# EAGLE design String Shooter (EAGLE 9.6.2)
REVISION: 1.0; SCH_DESC: An Example Schematic; TEAM: Example_Team_Number
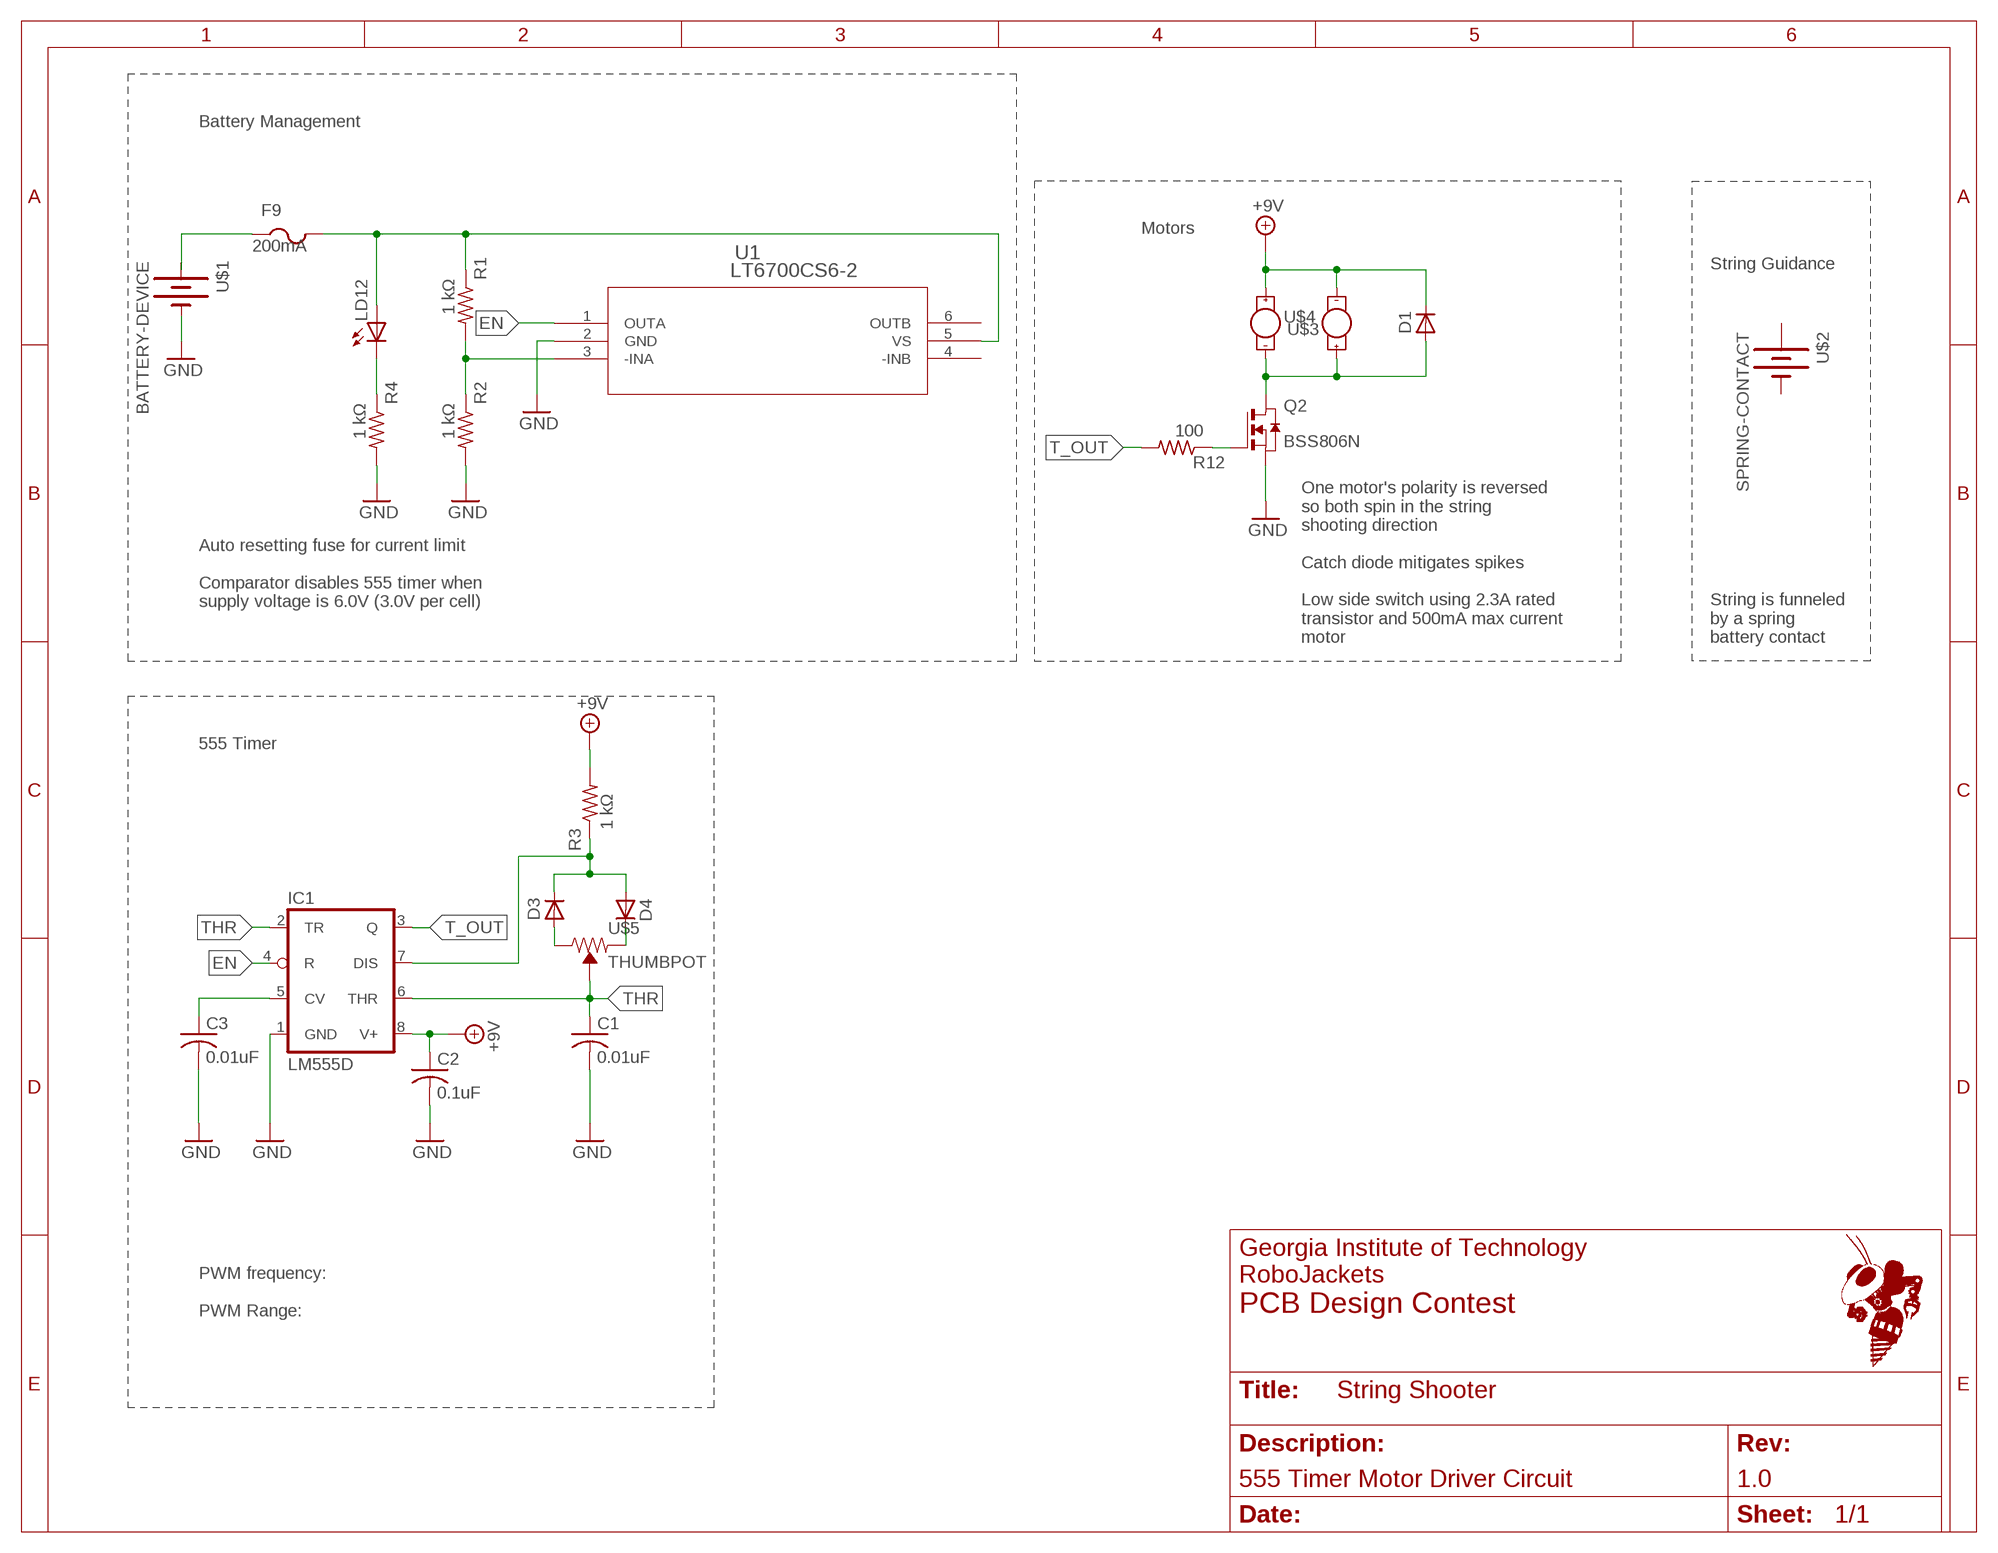
[diagram p0: schematic, sheet 1]
FRAME2 (FRAME_A_L): REVISION: 1.0; SCH_DESC: 555 Timer Motor Driver Circuit; TEAM: PCB Design Contest

## Parts
C1  0.01uF  C-USC0603  [C0603]
C2  0.1uF  C-USC0603  [C0603]
C3  0.01uF  C-USC0603  [C0603]
D1  DIODE-DO-214AC  [DO-214AC]
D3  DIODE-DO-214AC  [DO-214AC]
D4  DIODE-DO-214AC  [DO-214AC]
F9  200mA  PTCFUSE-1206  [R1206]
IC1  LM555D  [SO08]
LD12  BLUE  LEDCHIP-LED0603  [CHIP-LED0603]
Q2  BSS806N  [SOT-23-3]
R1  1 kΩ  R-US_R0603  [R0603]
R2  1 kΩ  R-US_R0603  [R0603]
R3  1 kΩ  R-US_R0603  [R0603]
R4  1 kΩ  R-US_R0603  [R0603]
R12  100  R-US_R0603  [R0603]
U1  LT6700CS6-2  [TSOT-23_S6]
U$1  BATTERY-DEVICE  [BATTERY-CASE]
U$2  SPRING-CONTACT  [SPRING-CONTACT]
U$3  LITTLE-MOTOR  [DC_MOTOR]
U$4  LITTLE-MOTOR  [DC_MOTOR]
U$5  THUMBPOT  [THUMBWHEEL-POT]

## Nets
+9V: C2.1 D1.C IC1.8(V+) R3.2
EN: IC1.4(R) U1.1(OUTA)
GND: C1.2 C2.2 C3.2 IC1.1(GND) Q2.2(S) R2.2 R4.2 U1.2(GND)
N$1: D4.C U$5.P$1(CCW)
N$2: D1.A Q2.3(D)
N$3: C3.1 IC1.5(CV)
N$10: D3.A U$5.P$3(CW)
N$11: D3.C D4.A IC1.7(DIS) R3.1
N$12: Q2.1(G) R12.1
N$13: R1.2 R2.1 U1.3(-INA)
N$14: LD12.C R4.1
N$15: F9.2 LD12.A R1.1 U1.5(VS)
N$16: F9.1
T_OUT: IC1.3(Q) R12.2
THR: C1.1 IC1.2(TR) IC1.6(THR) U$5.P$2(WIPER)
Unconnected: U1.4(-INB) U1.6(OUTB)

## Notes on the sheet
- Battery Management
- Motors
- String Guidance
- Auto resetting fuse for current limit
  
  Comparator disables 555 timer when
  supply voltage is 6.0V (3.0V per cell)
- One motor's polarity is reversed
  so both spin in the string
  shooting direction
  
  Catch diode mitigates spikes
  
  Low side switch using 2.3A rated
  transistor and 500mA max current
  motor
- String is funneled
  by a spring 
  battery contact
- 555 Timer
- PWM frequency:
  
  PWM Range:

## Library data of the parts
C1-C3 = rcl:C-US: CAPACITOR, American symbol; SPICEPREFIX: C
D1 D3 D4 = RoboJackets-Diodes:DIODE-: DIODE
F9 = adafruit:PTCFUSE: PTC fuses, resettable thermistors
IC1 = adafruit:*555: TIMER Changed DIP package to have round (not oval) pin pads http://www.ladyada.net/library/pcb/eaglelibrary.html
LD12 = led:LED: LED OSRAM: - CHIPLED LG R971, LG N971, LY N971, LG Q971, LY Q971, LO R971, LY R971 LH N974, LH R974 LS Q976, LO Q976, LY Q976 LO Q996 - Hyper CHIPLED LW Q18S LB Q993, LB Q99A, LB R99A - SideLED LS A670, LO A670, LY A670, LG A670, LP A670 LB A673, LV A673, LT A673, LW A673 LH A674 LY A675 LS A676, LA A676, LO A676, LY A676, LW A676 LS A679, LY A679, LG A679 - Hyper Micro SIDELED® LS Y876, LA Y876, LO Y876, LY Y876 LT Y87S - SmartLED LW L88C, LW L88S LB L89C, LB L89S, LG L890 LS L89K, LO L89K, LY L89K LS L896, LA L896, LO L896, LY L896 - TOPLED LS T670, LO T670, LY T670, LG T670, LP T670 LSG T670, LSP T670, LSY T670, LOP T670, LYG T670 LG T671, LOG T671, LSG T671 LB T673, LV T673, LT T673, LW T673 LH T674 LS T676, LA T676, LO T676, LY T676, LB T676, LH T676, LSB T676, LW T676 LB T67C, LV T67C, LT T67C, LS T67K, LO T67K, LY T67K, LW E67C LS E67B, LA E67B, LO E67B, LY E67B, LB E67C, LV E67C, LT E67C LW T67C LS T679, LY T679, LG T679 LS T770, LO T770, LY T770, LG T770, LP T770 LB T773, LV T773, LT T773, LW T773 LH T774 LS E675, LA E675, LY E675, LS T675 LS T776, LA T776, LO T776, LY T776, LB T776 LHGB T686 LT T68C, LB T68C - Hyper Mini TOPLED® LB M676 - Mini TOPLED Santana® LG M470 LS M47K, LO M47K, LY M47K Source: http://www.osram.convergy.de LUXEON: - LUMILED® LXK2-PW12-R00, LXK2-PW12-S00, LXK2-PW14-U00, LXK2-PW14-V00 LXK2-PM12-R00, LXK2-PM12-S00, LXK2-PM14-U00 LXK2-PE12-Q00, LXK2-PE12-R00, LXK2-PE12-S00, LXK2-PE14-T00, LXK2-PE14-U00 LXK2-PB12-K00, LXK2-PB12-L00, LXK2-PB12-M00, LXK2-PB14-N00, LXK2-PB14-P00, LXK2-PB14-Q00 LXK2-PR12-L00, LXK2-PR12-M00, LXK2-PR14-Q00, LXK2-PR14-R00 LXK2-PD12-Q00, LXK2-PD12-R00, LXK2-PD12-S00 LXK2-PH12-R00, LXK2-PH12-S00 LXK2-PL12-P00, LXK2-PL12-Q00, LXK2-PL12-R00 Source: www.luxeon.com KINGBRIGHT: KA-3528ASYC Source: www.kingbright.com
Q2 = RoboJackets-Discrete:BSS806N; DKPN: BSS806NH6327XTSA1CT-ND
R1-R4 R12 = rcl:R-US_: RESISTOR, American symbol; SPICEPREFIX: R
U1 = LT6700CS6-2:LT6700CS6-2; DESCRIPTION: Analog Comparators LT6700 - Micropower, Low Voltage, Dual Comparator with 400mV Reference; DIGI-KEY_PART_NUMBER: LT6700CS6-2#TRMPBFCT-ND; MF: Analog Devices / Linear Technology; MP: LT6700CS6-2; PACKAGE: None
U$1 = battery-stringshooter-holder-18650:BATTERY-DEVICE
U$2 = battery-contact-AA:SPRING-CONTACT
U$3 U$4 = motor-stringshooter:LITTLE-MOTOR
U$5 = Potentiometer_Thumbwheel:THUMBPOT

## Board
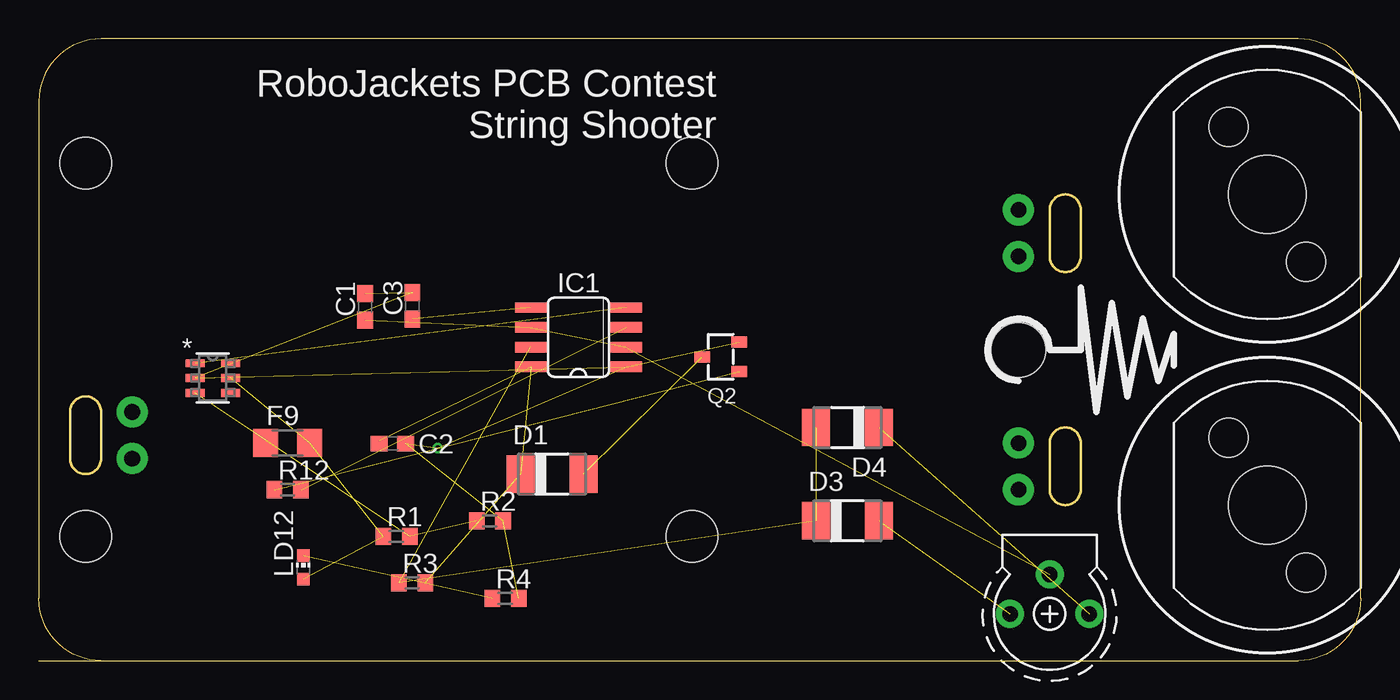
[diagram p1: board, top side]
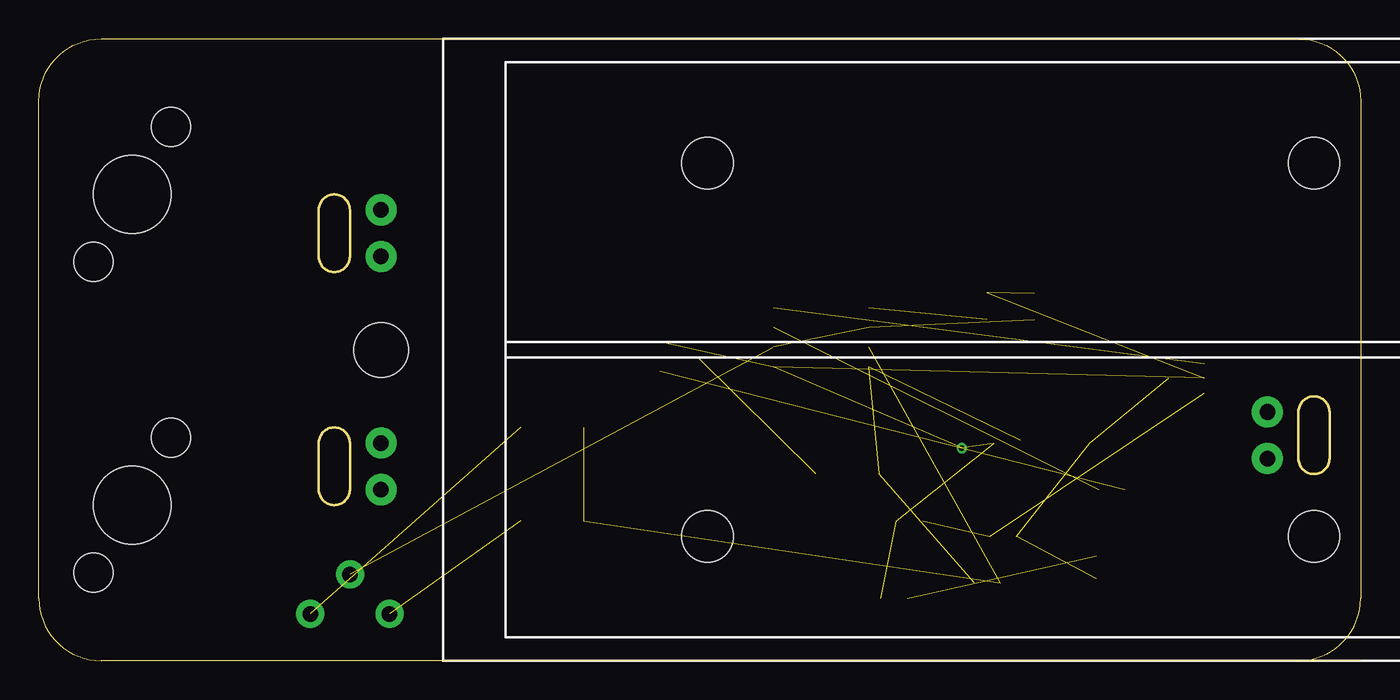
[diagram p2: board, bottom side, seen from below]

Size 85 x 40 mm. Coordinates in mm from the lower left corner, seen from the top.
Outline: 0,0 4,0
Outline: 4,0 81,0 arc90 85,4 85,36 arc90 81,40 4,40 arc90 0,36 0,4 arc90 4,0
Outline: 65,14 arc-180 67,14 67,11 arc-180 65,11 65,14
Outline: 65,29 arc-180 67,29 67,26 arc-180 65,26 65,29
Outline: 2,16 arc-180 4,16 4,13 arc-180 2,13 2,16
Copper layers (1*16): Top 0.035mm / dielectric 1.53mm / Bottom 0.035mm
Design rules "JLCPCB (2 Layer)": minimum track width 5mil, minimum drill 0.3mm, track to track 5mil, track to pad 5mil, pad to pad 5mil, via to via 20mil, smd to smd 5mil, copper to edge 0.2mm, drill to drill 21mil, minimum pad ring 6mil, minimum via ring 6mil, stop-mask expansion 0.05mm, vias tented up to drill 30mil, thermal gap 10mil

### Footprints (pad centres in the part's own frame; a part is rotated, then mirrored left to right if it is on the bottom)
C0603 = smd 1.1 x 1: 1 -0.85,0; 2 0.85,0
DO-214AC = smd 1.8 x 2.4: A 2.025,0; C -2.025,0
R1206 = smd 1.6 x 1.803: 1 -1.422,0; 2 1.422,0
SO08 = smd 0.66 x 2.032: 1 -1.905,-3.073; 2 -0.635,-3.073; 3 0.635,-3.073; 4 1.905,-3.073; 5 1.905,3.073; 6 0.635,3.073; 7 -0.635,3.073; 8 -1.905,3.073
CHIP-LED0603 = smd 0.8 x 0.8: A 0,-0.75; C 0,0.75
SOT-23-3 = smd 0.7 x 1: 1 -0.95,-1.2; 2 0.95,-1.2; 3 0,1.2
R0603 = smd 1 x 1.1: 1 -0.85,0; 2 0.85,0
TSOT-23_S6 = smd 1.219 x 0.508: 1 -1.143,0.95; 2 -1.143,0; 3 -1.143,-0.95; 4 1.143,-0.95; 5 1.143,0; 6 1.143,0.95
BATTERY-CASE = hole 3.3: 17,32; 56,32; 17,8; 56,8
SPRING-CONTACT = hole 3.5: 4,5
DC_MOTOR = hole 2.5: 3.5,12.33; 8.5,3.66 | hole 5: 6,8
THUMBWHEEL-POT = drill 1 pad 1.8: P$1 -2.54,0; P$2 0,-2.54; P$3 2.54,0

### Placement (x,y rotation side)
C1  20.98,22.76 90 top
C2  22.73,13.96 0 top
C3  24.03,22.82 90 top
D1  33,12 0 top
D3  52,9 0 top
D4  52,15 180 top
F9  16,14 0 top
IC1  34.7,20.8 90 top
LD12  17,6 0 top
Q2  43.85,19.54 90 top
R1  23,8 0 top
R2  29,9 0 top
R3  24,5 0 top
R4  30,4 0 top
R12  16,11 0 top
U1  11.18,18.18 0 top
U$1  59,0 0 bottom
U$2  59,15 0 top
U$3  73,22 0 top
U$4  73,2 0 top
U$5  65,3 180 top

### Tracks (layer width: path | path; a pad name or v marks a point on that pad's centre or on a via)
+9V  (3 unrouted)
  Top 0.2: IC1.8 31.65,18.88
  Top 0.4: 21.88,14.16 C2.1
EN  (1 unrouted)
GND  (via drill 0.35)  (8 unrouted)
  Top 0.2: IC1.1 37.79,18.88
  other vias: 25.65,13.67
N$1  (1 unrouted)
N$2  (1 unrouted)
N$3  (1 unrouted)
N$4  (via drill 1 pad 2)
  other vias: 63,29
N$5  (via drill 1 pad 2)
  other vias: 63,26
N$6  (via drill 1 pad 2)
  other vias: 63,14
N$7  (via drill 1 pad 2)
  other vias: 63,11
N$8  (via drill 1 pad 2)
  other vias: 6,16
N$9  (via drill 1 pad 2)
  other vias: 6,13
N$10  (1 unrouted)
N$11  (3 unrouted)
N$12  (1 unrouted)
N$13  (2 unrouted)
N$14  (1 unrouted)
N$15  (3 unrouted)
T_OUT  (1 unrouted)
THR  (3 unrouted)
  Top 0.2: IC1.2 37.83,20.11

### Text on the board
tPlace: RoboJackets PCB Contest / String Shooter